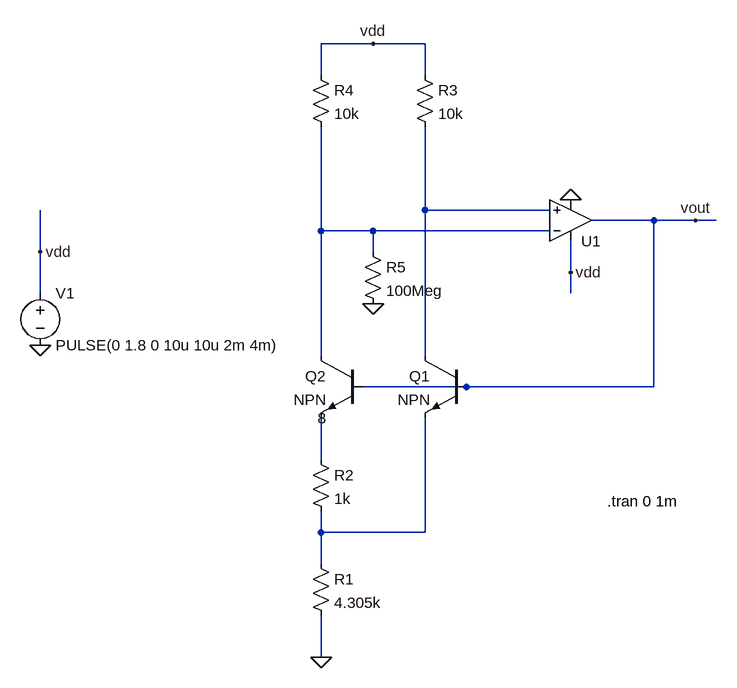
[diagram p0: schematic bandgap_reference.asc]
bandgap_reference.asc, the LTspice schematic file:
Version 4
SHEET 1 880 1028
WIRE 160 64 80 64
WIRE 240 64 160 64
WIRE 80 112 80 64
WIRE 240 112 240 64
WIRE 240 320 240 192
WIRE 432 320 240 320
WIRE 592 336 496 336
WIRE 656 336 592 336
WIRE 688 336 656 336
WIRE 80 352 80 192
WIRE 160 352 80 352
WIRE 432 352 160 352
WIRE -352 384 -352 320
WIRE 160 384 160 352
WIRE 464 416 464 368
WIRE -352 448 -352 384
WIRE 464 448 464 416
WIRE 80 544 80 352
WIRE 240 544 240 320
WIRE 304 592 144 592
WIRE 592 592 592 336
WIRE 592 592 304 592
WIRE 80 704 80 640
WIRE 80 816 80 784
WIRE 240 816 240 640
WIRE 240 816 80 816
WIRE 80 864 80 816
WIRE 80 1008 80 944
FLAG 464 304 0
FLAG -352 528 0
FLAG -352 384 vdd
FLAG 160 64 vdd
FLAG 464 416 vdd
FLAG 656 336 vout
FLAG 80 1008 0
FLAG 160 464 0
SYMBOL res 64 848 R0
SYMATTR InstName R1
SYMATTR Value 4.305k
SYMBOL res 64 688 R0
SYMATTR InstName R2
SYMATTR Value 1k
SYMBOL npn 304 544 M0
SYMATTR InstName Q1
SYMBOL npn 144 544 M0
WINDOW 123 56 96 Left 2
SYMATTR InstName Q2
SYMATTR Value2 8
SYMBOL res 224 96 R0
SYMATTR InstName R3
SYMATTR Value 10k
SYMBOL res 64 96 R0
SYMATTR InstName R4
SYMATTR Value 10k
SYMBOL OpAmps\\UniversalOpAmp2 464 336 M180
SYMATTR InstName U1
SYMBOL voltage -352 432 R0
WINDOW 123 24 124 Left 2
WINDOW 39 0 0 Left 0
SYMATTR InstName V1
SYMATTR Value PULSE(0 1.8 0 10u 10u 2m 4m)
SYMBOL res 144 368 R0
SYMATTR InstName R5
SYMATTR Value 100Meg
TEXT 520 768 Left 2 !.tran 0 1m

The netlist it stands for:
* bandgap_reference.asc
R1 N004 0 4.305k
R2 N003 N004 1k
Q1 N001 vout N004 0 NPN
Q2 N002 vout N003 0 NPN 8
R3 vdd N001 10k
R4 vdd N002 10k
XU1 N001 N002 vdd 0 vout level2 Avol=1Meg GBW=10Meg Slew=10Meg Ilimit=25m Rail=0 Vos=0 En=0 Enk=0 In=0 Ink=0 Rin=500Meg  ; pins In+ In- V+ V- OUT
V1 vdd 0 PULSE(0 1.8 0 10u 10u 2m 4m)
R5 N002 0 100Meg
.model NPN NPN
.model PNP PNP
.lib standard.bjt
.tran 0 1m
.lib UniversalOpAmp2.lib
.backanno
.end